# Altium schematic sheet QSPI.SchDoc: QSPI
size 420 x 297 mm; CompanyName: STMicroelectronics; Organization: Microcontrollers Division; DocumentNumber: 8; SheetNumber: 11; SheetTotal: 19
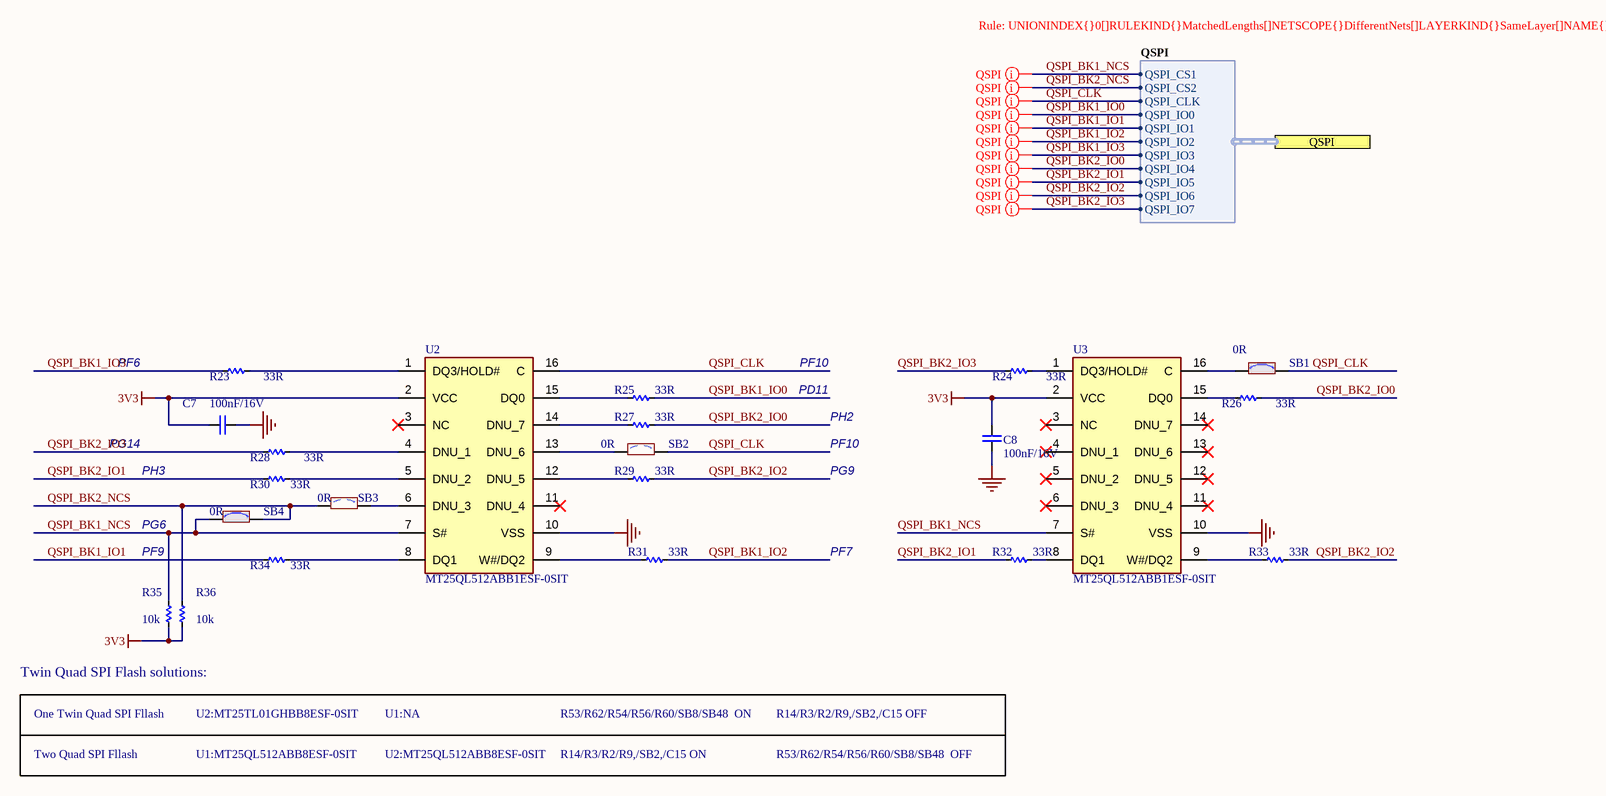
[diagram p0: QSPI.SchDoc]

## Parts
C7  100nF/16V  [CAP_C_1608X80]
C8  100nF/16V  [CAP_C_1608X80]
R23  33R  [RES_C_1608X60]
R24  33R  [RES_C_1608X60]
R25  33R  [RES_C_1608X60]
R26  33R  [RES_C_1608X60]
R27  33R  [RES_C_1608X60]
R28  33R  [RES_C_1608X60]
R29  33R  [RES_C_1608X60]
R30  33R  [RES_C_1608X60]
R31  33R  [RES_C_1608X60]
R32  33R  [RES_C_1608X60]
R33  33R  [RES_C_1608X60]
R34  33R  [RES_C_1608X60]
R35  10k  [RES_C_1608X60]
R36  10k  [RES_C_1608X60]
SB1  value 0R  [Jump2]  (hidden comment: SB_ON)
SB2  value 0R  [Jump2]  (hidden comment: SB_OFF)
SB3  value 0R  [Jump2]  (hidden comment: SB_OFF)
SB4  value 0R  [Jump2]  (hidden comment: SB_ON)
U2  MT25QL512ABB1ESF-0SIT  [SOIC127P1032X265-16N]
U3  MT25QL512ABB1ESF-0SIT  [SOIC127P1032X265-16N]

## Ports
QSPI (harness QSPI)

## Harnesses
QSPI: QSPI_IO1, QSPI_IO0, QSPI_CLK, QSPI_CS1, QSPI_IO2, QSPI_IO3, QSPI_IO5, QSPI_IO4, QSPI_IO6, QSPI_IO7, QSPI_CS2

## Nets
3V3: C7.2 C8.1 R35.1 R36.1 U2.2(VCC) U3.2(VCC)
GND: C7.1 C8.2 U2.10(VSS) U3.10(VSS)
QSPI_BK1_IO0: R25.2 ; port QSPI.QSPI_IO0
QSPI_BK1_IO1: R34.1 ; port QSPI.QSPI_IO1
QSPI_BK1_IO2: R31.2 ; port QSPI.QSPI_IO2
QSPI_BK1_IO3: R23.1 ; port QSPI.QSPI_IO3
QSPI_BK1_NCS: R35.2 SB4.1 U2.7(S#) U3.7(S#) ; port QSPI.QSPI_CS1
QSPI_BK2_IO0: R26.2 R27.2 ; port QSPI.QSPI_IO4
QSPI_BK2_IO1: R30.1 R32.1 ; port QSPI.QSPI_IO5
QSPI_BK2_IO2: R29.2 R33.2 ; port QSPI.QSPI_IO6
QSPI_BK2_IO3: R24.1 R28.1 ; port QSPI.QSPI_IO7
QSPI_BK2_NCS: R36.2 SB3.1 SB4.2 ; port QSPI.QSPI_CS2
QSPI_CLK: SB1.2 SB2.2 U2.16(C) ; port QSPI.QSPI_CLK
NetR23_2: R23.2 U2.1(DQ3/HOLD#)
NetR24_2: R24.2 U3.1(DQ3/HOLD#)
NetR25_1: R25.1 U2.15(DQ0)
NetR26_1: R26.1 U3.15(DQ0)
NetR27_1: R27.1 U2.14(DNU_7)
NetR28_2: R28.2 U2.4(DNU_1)
NetR29_1: R29.1 U2.12(DNU_5)
NetR30_2: R30.2 U2.5(DNU_2)
NetR31_1: R31.1 U2.9(W#/DQ2)
NetR32_2: R32.2 U3.8(DQ1)
NetR33_1: R33.1 U3.9(W#/DQ2)
NetR34_2: R34.2 U2.8(DQ1)
NetSB1_1: SB1.1 U3.16(C)
NetSB2_1: SB2.1 U2.13(DNU_6)
NetSB3_2: SB3.2 U2.6(DNU_3)

Not connected (* = marked no-connect by the designer): U2 3(NC)* 11(DNU_4)*; U3 3(NC)* 4(DNU_1)* 5(DNU_2)* 6(DNU_3)* 11(DNU_4)* 12(DNU_5)* 13(DNU_6)* 14(DNU_7)*

## Layout directives
rule Matched Net Lengths [Tolerance = 100mil]: QSPI_BK1_IO0, QSPI_BK1_IO1, QSPI_BK1_IO2, QSPI_BK1_IO3, QSPI_BK1_NCS, QSPI_BK2_IO0, QSPI_BK2_IO1, QSPI_BK2_IO2, QSPI_BK2_IO3, QSPI_BK2_NCS, QSPI_CLK

## Notes on the sheet
- PF6
- PF10
- PG14
- PD11
- PH2
- PH3
- PG9
- PF9
- PG6
- PF7
- Twin Quad SPI Flash solutions:
- One Twin Quad SPI Fllash
- U2:MT25TL01GHBB8ESF-0SIT
- U1:NA
- R53/R62/R54/R56/R60/SB8/SB48  ON
- R14/R3/R2/R9,/SB2,/C15 OFF
- Two Quad SPI Fllash
- U1:MT25QL512ABB8ESF-0SIT
- U2:MT25QL512ABB8ESF-0SIT
- R14/R3/R2/R9,/SB2,/C15 ON
- R53/R62/R54/R56/R60/SB8/SB48  OFF
- Sub-system:
- Design by:
- Sheet title:
- Project:
- Sheet:
- of
- Checked by:
- Approved by:
- Doc no:
- Revision:
- Size:
- Date:

## Library data of the parts
C7 C8 = CAP_SMD: CAP_Chip; Value: 33pF
R23-R36 = _RES_B_2: RES
SB1 SB4 = MCD-00071: Solder Bridge ON; Part_Type: Resistor; Manufacturer: YAGEO; Manufacturer_HQ_COO: Unknown; Manufacturer_Part_Number: RC0603JR-070RL; Part_Preference: Recommended; Provided_By: Subcon; Initial_Board_Reference: mb1274; Component_Country_Of_Origin: China; ID: 2521; Order_Code_RS: 199-5647; ShowFields: YES; Internal_Part_Number: MCD-00071; ECCN_US: n/a; ECCN_EU: n/a; Status: Released; ComponentLink1URL: http://tunmcdsvn.tun.st.com/Component_Documentation_Library/Trunk/Resistor/YAGEO_RC_Series; Order_Code_Digikey: 311-0.0GRTR-ND; Order_Code_Farnell: 2421846; Package: 0603
SB2 SB3 = MCD-00072: Solder Bridge OFF; Part_Type: Resistor; Manufacturer: YAGEO; Manufacturer_HQ_COO: Unknown; Manufacturer_Part_Number: RC0603JR-070RL; Part_Preference: Recommended; Initial_Board_Reference: mb1274; Component_Country_Of_Origin: China; ID: 2520; Order_Code_RS: 199-5647; ShowFields: YES; Internal_Part_Number: MCD-00072; Status: Released; ECCN_US: n/a; ECCN_EU: n/a; Provided_By: n/a; ComponentLink1URL: http://tunmcdsvn.tun.st.com/Component_Documentation_Library/Trunk/Resistor/YAGEO_RC_Series; Order_Code_Digikey: 311-0.0GRTR-ND; Order_Code_Farnell: 2421846; Package: 0603
U2 U3 = MT25QL512ABB1ESF-0SIT: IC FLASH 512MBIT 133MHZ 16SO; Manufacturer_Name: Micron; Manufacturer_Part_Number: MT25QL512ABB8ESF-0SIT; Geometry.Height: 2.65mm; Mouser Part Number: 340-278183-TRAY; Mouser Price/Stock: https://www.mouser.co.uk/ProductDetail/Micron/MT25QL512ABB8ESF-0SIT?qs=rrS6PyfT74e8sADX0P8kAw%3D%3D; Arrow Part Number: MT25QL512ABB8ESF-0SIT; Arrow Price/Stock: https://www.arrow.com/en/products/mt25ql512abb8esf-0sit/micron-technology?utm_currency=USD&region=nac; Datasheet Link: https://datasheet.datasheetarchive.com/originals/distributors/DKDS42/DSANUWW0045437.pdf